# EAGLE schematic xambi_1.0 (EAGLE 6.5.4)
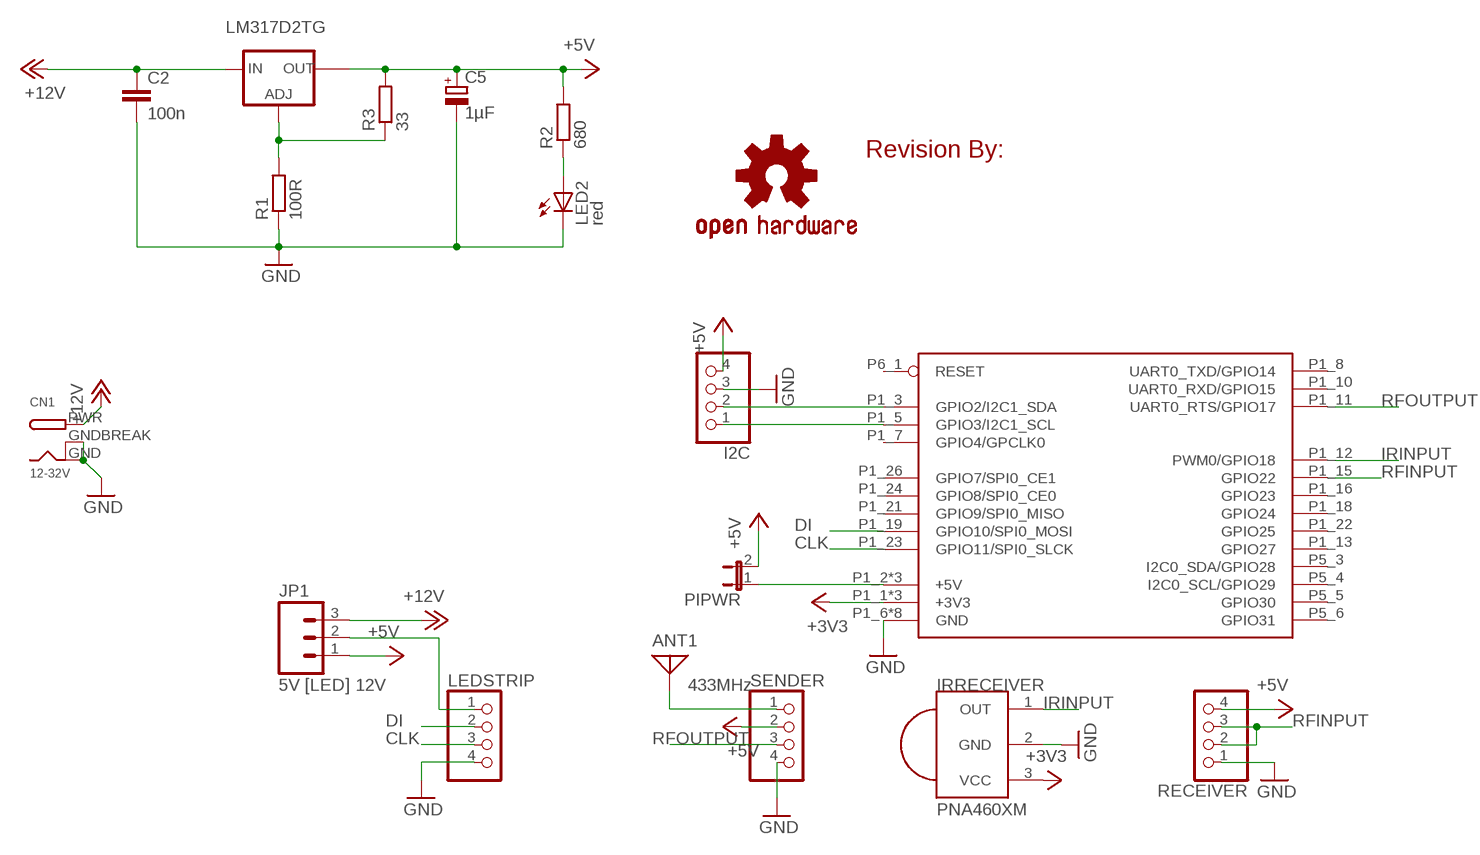
[diagram p0: schematic, sheet 1]

## Parts
ANT1  433MHz  ANTENNA  [PAD-01]
C2  100n  C-EUC1206  [C1206]
C5  1µF  CPOL-EUUD-4X5,8  [UD-4X5,8_NICHICON]
CN1  12-32V  DCBARRELPTH  [DCJACK_2MM_PTH]
I2C  PINHD-1X4  [1X04]
IRRECEIVER  PNA460XM  [PNA460XM]
JP1  5V [LED] 12V  M03PTH  [1X03]
LED2  red  LEDCHIPLED_1206  [CHIPLED_1206]
LEDSTRIP  PINHD-1X4  [1X04]
LM317D2TG  LM1084IS  [TO263]
LOGO1  OSHW-LOGOS  [OSHW-LOGO-S]
PIPWR  JP1E  [JP1]
R1  100R  R-EU_R1206  [R1206]
R2  680  R-EU_R1206  [R1206]
R3  33  R-EU_R1206  [R1206]
RECEIVER  PINHD-1X4  [1X04]
SENDER  PINHD-1X4  [1X04]
U$2  REVISION  [REVISION]
XAMBI_SHIELD_1.0  XPIX Dev. / 2014  RPI-B-V2NO_SHIELD  [RPI-B-V2]

## Nets
+3V3: IRRECEIVER.3(VCC) XAMBI_SHIELD_1.0.P1_1(+3V3) XAMBI_SHIELD_1.0.P1_17(+3V3) XAMBI_SHIELD_1.0.P5_2(+3V3)
+5V [power]: C5.+ I2C.4 JP1.1 LM317D2TG.2(OUT) PIPWR.2 R2.2 R3.2 RECEIVER.4 SENDER.2
+12V [power]: C2.1 CN1.PWR JP1.3 LM317D2TG.3(IN)
CLK: LEDSTRIP.3 XAMBI_SHIELD_1.0.P1_23(GPIO11/SPI0_SLCK)
DI: LEDSTRIP.2 XAMBI_SHIELD_1.0.P1_19(GPIO10/SPI0_MOSI)
GND [power]: C2.2 C5.- CN1.GND CN1.GNDBREAK I2C.3 IRRECEIVER.2(GND) LED2.C LEDSTRIP.4 R1.1 RECEIVER.1 SENDER.4 XAMBI_SHIELD_1.0.P1_6(GND) XAMBI_SHIELD_1.0.P1_9(GND) XAMBI_SHIELD_1.0.P1_14(GND) XAMBI_SHIELD_1.0.P1_20(GND) XAMBI_SHIELD_1.0.P1_25(GND) XAMBI_SHIELD_1.0.P5_7(GND) XAMBI_SHIELD_1.0.P5_8(GND) XAMBI_SHIELD_1.0.P6_2(GND)
IRINPUT: IRRECEIVER.1(OUT) XAMBI_SHIELD_1.0.P1_12(PWM0/GPIO18)
N$1: I2C.2 XAMBI_SHIELD_1.0.P1_3(GPIO2/I2C1_SDA)
N$3 [power]: PIPWR.1 XAMBI_SHIELD_1.0.P1_2(+5V) XAMBI_SHIELD_1.0.P1_4(+5V) XAMBI_SHIELD_1.0.P5_1(+5V)
N$4: ANT1.1 SENDER.1
N$5 [power]: JP1.2 LEDSTRIP.1
N$6: I2C.1 XAMBI_SHIELD_1.0.P1_5(GPIO3/I2C1_SCL)
N$7: LED2.A R2.1
N$8 [power]: LM317D2TG.1(ADJ) R1.2 R3.1
RFINPUT: RECEIVER.2 RECEIVER.3 XAMBI_SHIELD_1.0.P1_15(GPIO22)
RFOUTPUT: SENDER.3 XAMBI_SHIELD_1.0.P1_11(UART0_RTS/GPIO17)
Unconnected: LM317D2TG.4(OUT4) XAMBI_SHIELD_1.0.P1_7(GPIO4/GPCLK0) XAMBI_SHIELD_1.0.P1_8(UART0_TXD/GPIO14) XAMBI_SHIELD_1.0.P1_10(UART0_RXD/GPIO15) XAMBI_SHIELD_1.0.P1_13(GPIO27) XAMBI_SHIELD_1.0.P1_16(GPIO23) XAMBI_SHIELD_1.0.P1_18(GPIO24) XAMBI_SHIELD_1.0.P1_21(GPIO9/SPI0_MISO) XAMBI_SHIELD_1.0.P1_22(GPIO25) XAMBI_SHIELD_1.0.P1_24(GPIO8/SPI0_CE0) XAMBI_SHIELD_1.0.P1_26(GPIO7/SPI0_CE1)

## Power pins joined to a net without a drawn wire
GPIO30: XAMBI_SHIELD_1.0.P5_5(GPIO30)
GPIO31: XAMBI_SHIELD_1.0.P5_6(GPIO31)
I2C0_SCL/GPIO29: XAMBI_SHIELD_1.0.P5_4(I2C0_SCL/GPIO29)
I2C0_SDA/GPIO28: XAMBI_SHIELD_1.0.P5_3(I2C0_SDA/GPIO28)
RESET: XAMBI_SHIELD_1.0.P6_1(RESET)

## Library data of the parts
ANT1 = discrete:ANTENNA: Antenna
C2 = rcl:C-EU: CAPACITOR, European symbol
C5 = rcl:CPOL-EU: POLARIZED CAPACITOR, European symbol
CN1 = _adafruit:DCBARREL: 2.0mm DC Barrel Jack DCJACK_2MM_PTH - Through Hole Jack (4UConnector: 05537)
I2C LEDSTRIP RECEIVER SENDER = pinhead:PINHD-1X4: PIN HEADER
IRRECEIVER = _adafruit:PNA460XM: IR 38KHz receiver PNA4602 and related receivers http://www.ladyada.net/library/pcb/eaglelibrary.html
JP1 = SparkFun-Connectors:M03: Header 3 Standard 3-pin 0.1" header. Use with straight break away headers (SKU : PRT-00116), right angle break away headers (PRT-00553), swiss pins (PRT-00743), machine pins (PRT-00117), and female headers (PRT-00115). Molex polarized connector foot print use with SKU : PRT-08232 with associated crimp pins and housings.
LED2 = _adafruit:LED: LED OSRAM: - CHIPLED LG R971, LG N971, LY N971, LG Q971, LY Q971, LO R971, LY R971 LH N974, LH R974 LS Q976, LO Q976, LY Q976 LO Q996 - Hyper CHIPLED LW Q18S LB Q993, LB Q99A, LB R99A - SideLED LS A670, LO A670, LY A670, LG A670, LP A670 LB A673, LV A673, LT A673, LW A673 LH A674 LY A675 LS A676, LA A676, LO A676, LY A676, LW A676 LS A679, LY A679, LG A679 - Hyper Micro SIDELED® LS Y876, LA Y876, LO Y876, LY Y876 LT Y87S - SmartLED LW L88C, LW L88S LB L89C, LB L89S, LG L890 LS L89K, LO L89K, LY L89K LS L896, LA L896, LO L896, LY L896 - TOPLED LS T670, LO T670, LY T670, LG T670, LP T670 LSG T670, LSP T670, LSY T670, LOP T670, LYG T670 LG T671, LOG T671, LSG T671 LB T673, LV T673, LT T673, LW T673 LH T674 LS T676, LA T676, LO T676, LY T676, LB T676, LH T676, LSB T676, LW T676 LB T67C, LV T67C, LT T67C, LS T67K, LO T67K, LY T67K, LW E67C LS E67B, LA E67B, LO E67B, LY E67B, LB E67C, LV E67C, LT E67C LW T67C LS T679, LY T679, LG T679 LS T770, LO T770, LY T770, LG T770, LP T770 LB T773, LV T773, LT T773, LW T773 LH T774 LS E675, LA E675, LY E675, LS T675 LS T776, LA T776, LO T776, LY T776, LB T776 LHGB T686 LT T68C, LB T68C - Hyper Mini TOPLED® LB M676 - Mini TOPLED Santana® LG M470 LS M47K, LO M47K, LY M47K Source: http://www.osram.convergy.de/
LM317D2TG = v-reg:LM1084IS: VOLTAGE REGULATOR
LOGO1 = SparkFun-Aesthetics:OSHW-LOGO: Open Source Hardware Logo This logo indicates the piece of hardware it is found on incorporates a OSHW license and/or adheres to the definition of open source hardware found here: http://freedomdefined.org/OSHW
PIPWR = jumper:JP1E: JUMPER
R1-R3 = rcl:R-EU_: RESISTOR, European symbol
U$2 = SparkFun-Aesthetics:REVISION
XAMBI_SHIELD_1.0 = raspberry:RPI-B-V2: Second revision of the Model 2 board including the P5 and P6 headers. Mounting holes have been added. Choose the "SHIELD" variant for a predefined Dimension layer and drilling holes. Theres also a "SHIELD" variant for the Model A without a RJ45 connector.

## Net classes
0 default: width 0.203 mm, drill 0.254 mm, clearance 0.152 mm
1 power: width 0.508 mm, drill 0.305 mm, clearance 0.203 mm